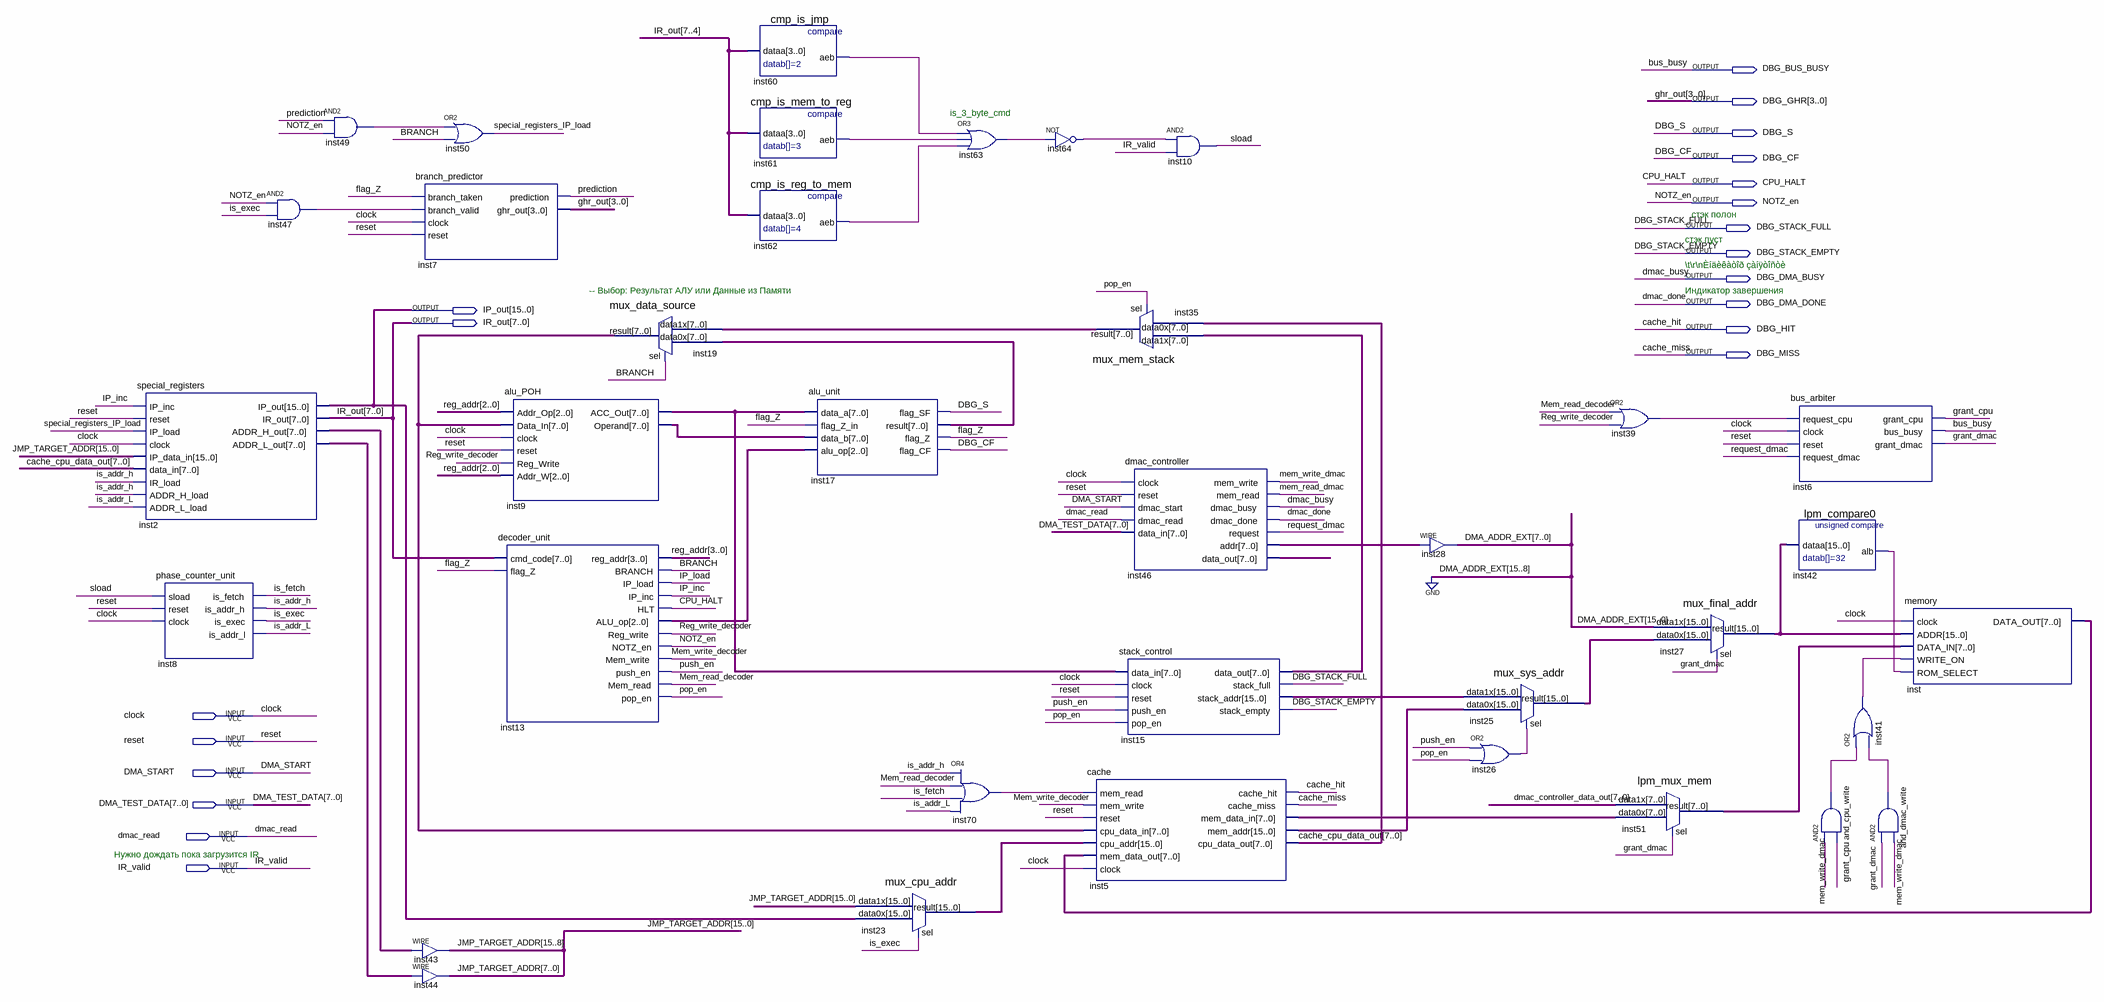
[diagram p0: schematic sheet]
// Quartus schematic main_module.bdf as structural Verilog: 36 symbols, 20 pins
module main_module (
  input  clock,
  input  reset,
  input  DMA_START,
  input  [7:0] DMA_TEST_DATA,
  input  dmac_read,
  input  IR_valid,
  output DBG_BUS_BUSY,
  output [3:0] DBG_GHR,
  output DBG_S,
  output DBG_CF,
  output CPU_HALT,
  output NOTZ_en,
  output DBG_STACK_FULL,
  output DBG_STACK_EMPTY,
  output DBG_DMA_BUSY,
  output DBG_DMA_DONE,
  output [15:0] IP_out,
  output [7:0] IR_out,
  output DBG_HIT,
  output DBG_MISS
);

  wire and_cpu_write_out, and_dmac_write_out, BRANCH, flag_Z, grant_cpu, grant_dmac, inst26_out, inst39_out,
       inst41_out, inst42_alb, inst47_out, inst49_out, inst60_aeb, inst61_aeb, inst62_aeb, inst63_out,
       inst64_out, inst70_out, IP_inc, IP_load, is_addr_h, is_addr_L, is_exec, is_fetch, Mem_read_decoder,
       mem_read_dmac, Mem_write_decoder, mem_write_dmac, pop_en, prediction, push_en, Reg_write_decoder,
       request_dmac, sload, special_registers_IP_load;
  wire [2:0] inst13_alu_op;
  wire [3:0] reg_addr;
  wire [7:0] cache_cpu_data_out, DMA_ADDR_EXT, dmac_controller_data_out, inst2_addr_h_out, inst2_addr_l_out,
       inst5_mem_data_in, inst9_acc_out, inst9_operand, inst15_data_out, inst17_result, inst19_result,
       inst35_result, inst46_addr, inst51_result, inst_data_out;
  wire [15:0] inst5_mem_addr, inst15_stack_addr, inst23_result, inst25_result, inst27_result, JMP_TARGET_ADDR;

  special_registers inst2 (
    .IP_inc(IP_inc), .reset(reset), .IP_load(special_registers_IP_load), .clock(clock),
    .IP_data_in(JMP_TARGET_ADDR), .data_in(cache_cpu_data_out), .IR_load(is_addr_h), .ADDR_H_load(is_addr_h),
    .ADDR_L_load(is_addr_L), .IP_out(IP_out), .IR_out(IR_out), .ADDR_H_out(inst2_addr_h_out),
    .ADDR_L_out(inst2_addr_l_out));
  phase_counter_unit inst8 (
    .sload(sload), .reset(reset), .clock(clock), .is_fetch(is_fetch), .is_addr_h(is_addr_h),
    .is_exec(is_exec), .is_addr_l(is_addr_L));
  and inst47 (inst47_out, NOTZ_en, is_exec);
  and inst49 (inst49_out, prediction, NOTZ_en);
  or inst50 (special_registers_IP_load, inst49_out, BRANCH);
  branch_predictor inst7 (
    .branch_taken(flag_Z), .branch_valid(inst47_out), .clock(clock), .reset(reset), .prediction(prediction),
    .ghr_out(DBG_GHR));
  assign JMP_TARGET_ADDR[15:8] = inst2_addr_h_out;  // WIRE inst43
  assign JMP_TARGET_ADDR[7:0] = inst2_addr_l_out;  // WIRE inst44
  alu_POH inst9 (
    .Addr_Op(reg_addr[2:0]), .Data_In(inst19_result), .clock(clock), .reset(reset),
    .Reg_Write(Reg_write_decoder), .Addr_W(reg_addr[2:0]), .ACC_Out(inst9_acc_out), .Operand(inst9_operand));
  decoder_unit inst13 (
    .cmd_code(IR_out), .flag_Z(flag_Z), .reg_addr(reg_addr), .BRANCH(BRANCH), .IP_load(IP_load),
    .IP_inc(IP_inc), .HLT(CPU_HALT), .ALU_op(inst13_alu_op), .Reg_write(Reg_write_decoder),
    .NOTZ_en(NOTZ_en), .Mem_write(Mem_write_decoder), .push_en(push_en), .Mem_read(Mem_read_decoder),
    .pop_en(pop_en));
  mux_data_source inst19 (.data1x(inst35_result), .data0x(inst17_result), .sel(BRANCH), .result(inst19_result));
  cmp_is_jmp inst60 (.dataa(IR_out[7:4]), .aeb(inst60_aeb));
  cmp_is_mem_to_reg inst61 (.dataa(IR_out[7:4]), .aeb(inst61_aeb));
  cmp_is_reg_to_mem inst62 (.dataa(IR_out[7:4]), .aeb(inst62_aeb));
  alu_unit inst17 (
    .data_a(inst9_acc_out), .flag_Z_in(flag_Z), .data_b(inst9_operand), .alu_op(inst13_alu_op),
    .flag_SF(DBG_S), .result(inst17_result), .flag_Z(flag_Z), .flag_CF(DBG_CF));
  mux_cpu_addr inst23 (.data1x(JMP_TARGET_ADDR), .data0x(IP_out), .sel(is_exec), .result(inst23_result));
  or inst63 (inst63_out, inst60_aeb, inst61_aeb, inst62_aeb);
  or inst70 (inst70_out, is_addr_h, Mem_read_decoder, is_fetch, is_addr_L);
  not inst64 (inst64_out, inst63_out);
  mux_mem_stack inst35 (.data1x(inst15_data_out), .data0x(cache_cpu_data_out), .sel(pop_en), .result(inst35_result));
  stack_control inst15 (
    .data_in(inst9_acc_out), .clock(clock), .reset(reset), .push_en(push_en), .pop_en(pop_en),
    .data_out(inst15_data_out), .stack_full(DBG_STACK_FULL), .stack_addr(inst15_stack_addr),
    .stack_empty(DBG_STACK_EMPTY));
  cache inst5 (
    .mem_read(inst70_out), .mem_write(Mem_write_decoder), .reset(reset), .cpu_data_in(inst19_result),
    .cpu_addr(inst23_result), .mem_data_out(inst_data_out), .clock(clock), .cache_hit(DBG_HIT),
    .cache_miss(DBG_MISS), .mem_data_in(inst5_mem_data_in), .mem_addr(inst5_mem_addr),
    .cpu_data_out(cache_cpu_data_out));
  and inst10 (sload, inst64_out, IR_valid);
  dmac_controller inst46 (
    .clock(clock), .reset(reset), .dmac_start(DMA_START), .dmac_read(dmac_read), .data_in(DMA_TEST_DATA),
    .mem_write(mem_write_dmac), .mem_read(mem_read_dmac), .dmac_busy(DBG_DMA_BUSY), .dmac_done(DBG_DMA_DONE),
    .request(request_dmac), .addr(inst46_addr), .data_out(dmac_controller_data_out));
  assign DMA_ADDR_EXT = inst46_addr;  // WIRE inst28
  mux_sys_addr inst25 (.data1x(inst15_stack_addr), .data0x(inst5_mem_addr), .sel(inst26_out), .result(inst25_result));
  or inst26 (inst26_out, push_en, pop_en);
  or inst39 (inst39_out, Mem_read_decoder, Reg_write_decoder);
  lpm_mux_mem inst51 (
    .data1x(dmac_controller_data_out), .data0x(inst5_mem_data_in), .sel(grant_dmac), .result(inst51_result));
  mux_final_addr inst27 (
    .data1x({{8{1'b0}}, DMA_ADDR_EXT}), .data0x(inst25_result), .sel(grant_dmac), .result(inst27_result));
  bus_arbiter inst6 (
    .request_cpu(inst39_out), .clock(clock), .reset(reset), .request_dmac(request_dmac),
    .grant_cpu(grant_cpu), .bus_busy(DBG_BUS_BUSY), .grant_dmac(grant_dmac));
  lpm_compare0 inst42 (.dataa(inst27_result), .alb(inst42_alb));
  and and_cpu_write (and_cpu_write_out, mem_write_dmac, grant_cpu);
  or inst41 (inst41_out, and_cpu_write_out, and_dmac_write_out);
  and and_dmac_write (and_dmac_write_out, grant_dmac, mem_write_dmac);
  memory inst (
    .clock(clock), .ADDR(inst27_result), .DATA_IN(inst51_result), .WRITE_ON(inst41_out),
    .ROM_SELECT(inst42_alb), .DATA_OUT(inst_data_out));

  // Other names for the same wires on the sheet: bus_busy = DBG_BUS_BUSY; cache_hit = DBG_HIT; cache_miss = DBG_MISS;
  //   dmac_busy = DBG_DMA_BUSY; dmac_done = DBG_DMA_DONE; ghr_out[3:0] = DBG_GHR

  // Notes on the sheet:
  //   is_3_byte_cmd
  //   стэк полон
  //   стэк пуст
  //   \t\r\nÈíäèêàòîð çàíÿòîñòè
  //   -- Выбор: Результат АЛУ или Данные из Памяти
  //   Индикатор завершения
  //   Нужно дождать пока загрузится IR
endmodule
